# EasyEDA schematic SCH_Recovery-Heltec-Nakuja_2022-10-19.json
TITLE: sheet1; REV: 1.0; Date: 2022-08-31; Sheet: 1/1; Drawn By: bangegeorgeogeto; Company: JKUAT NAKUJA
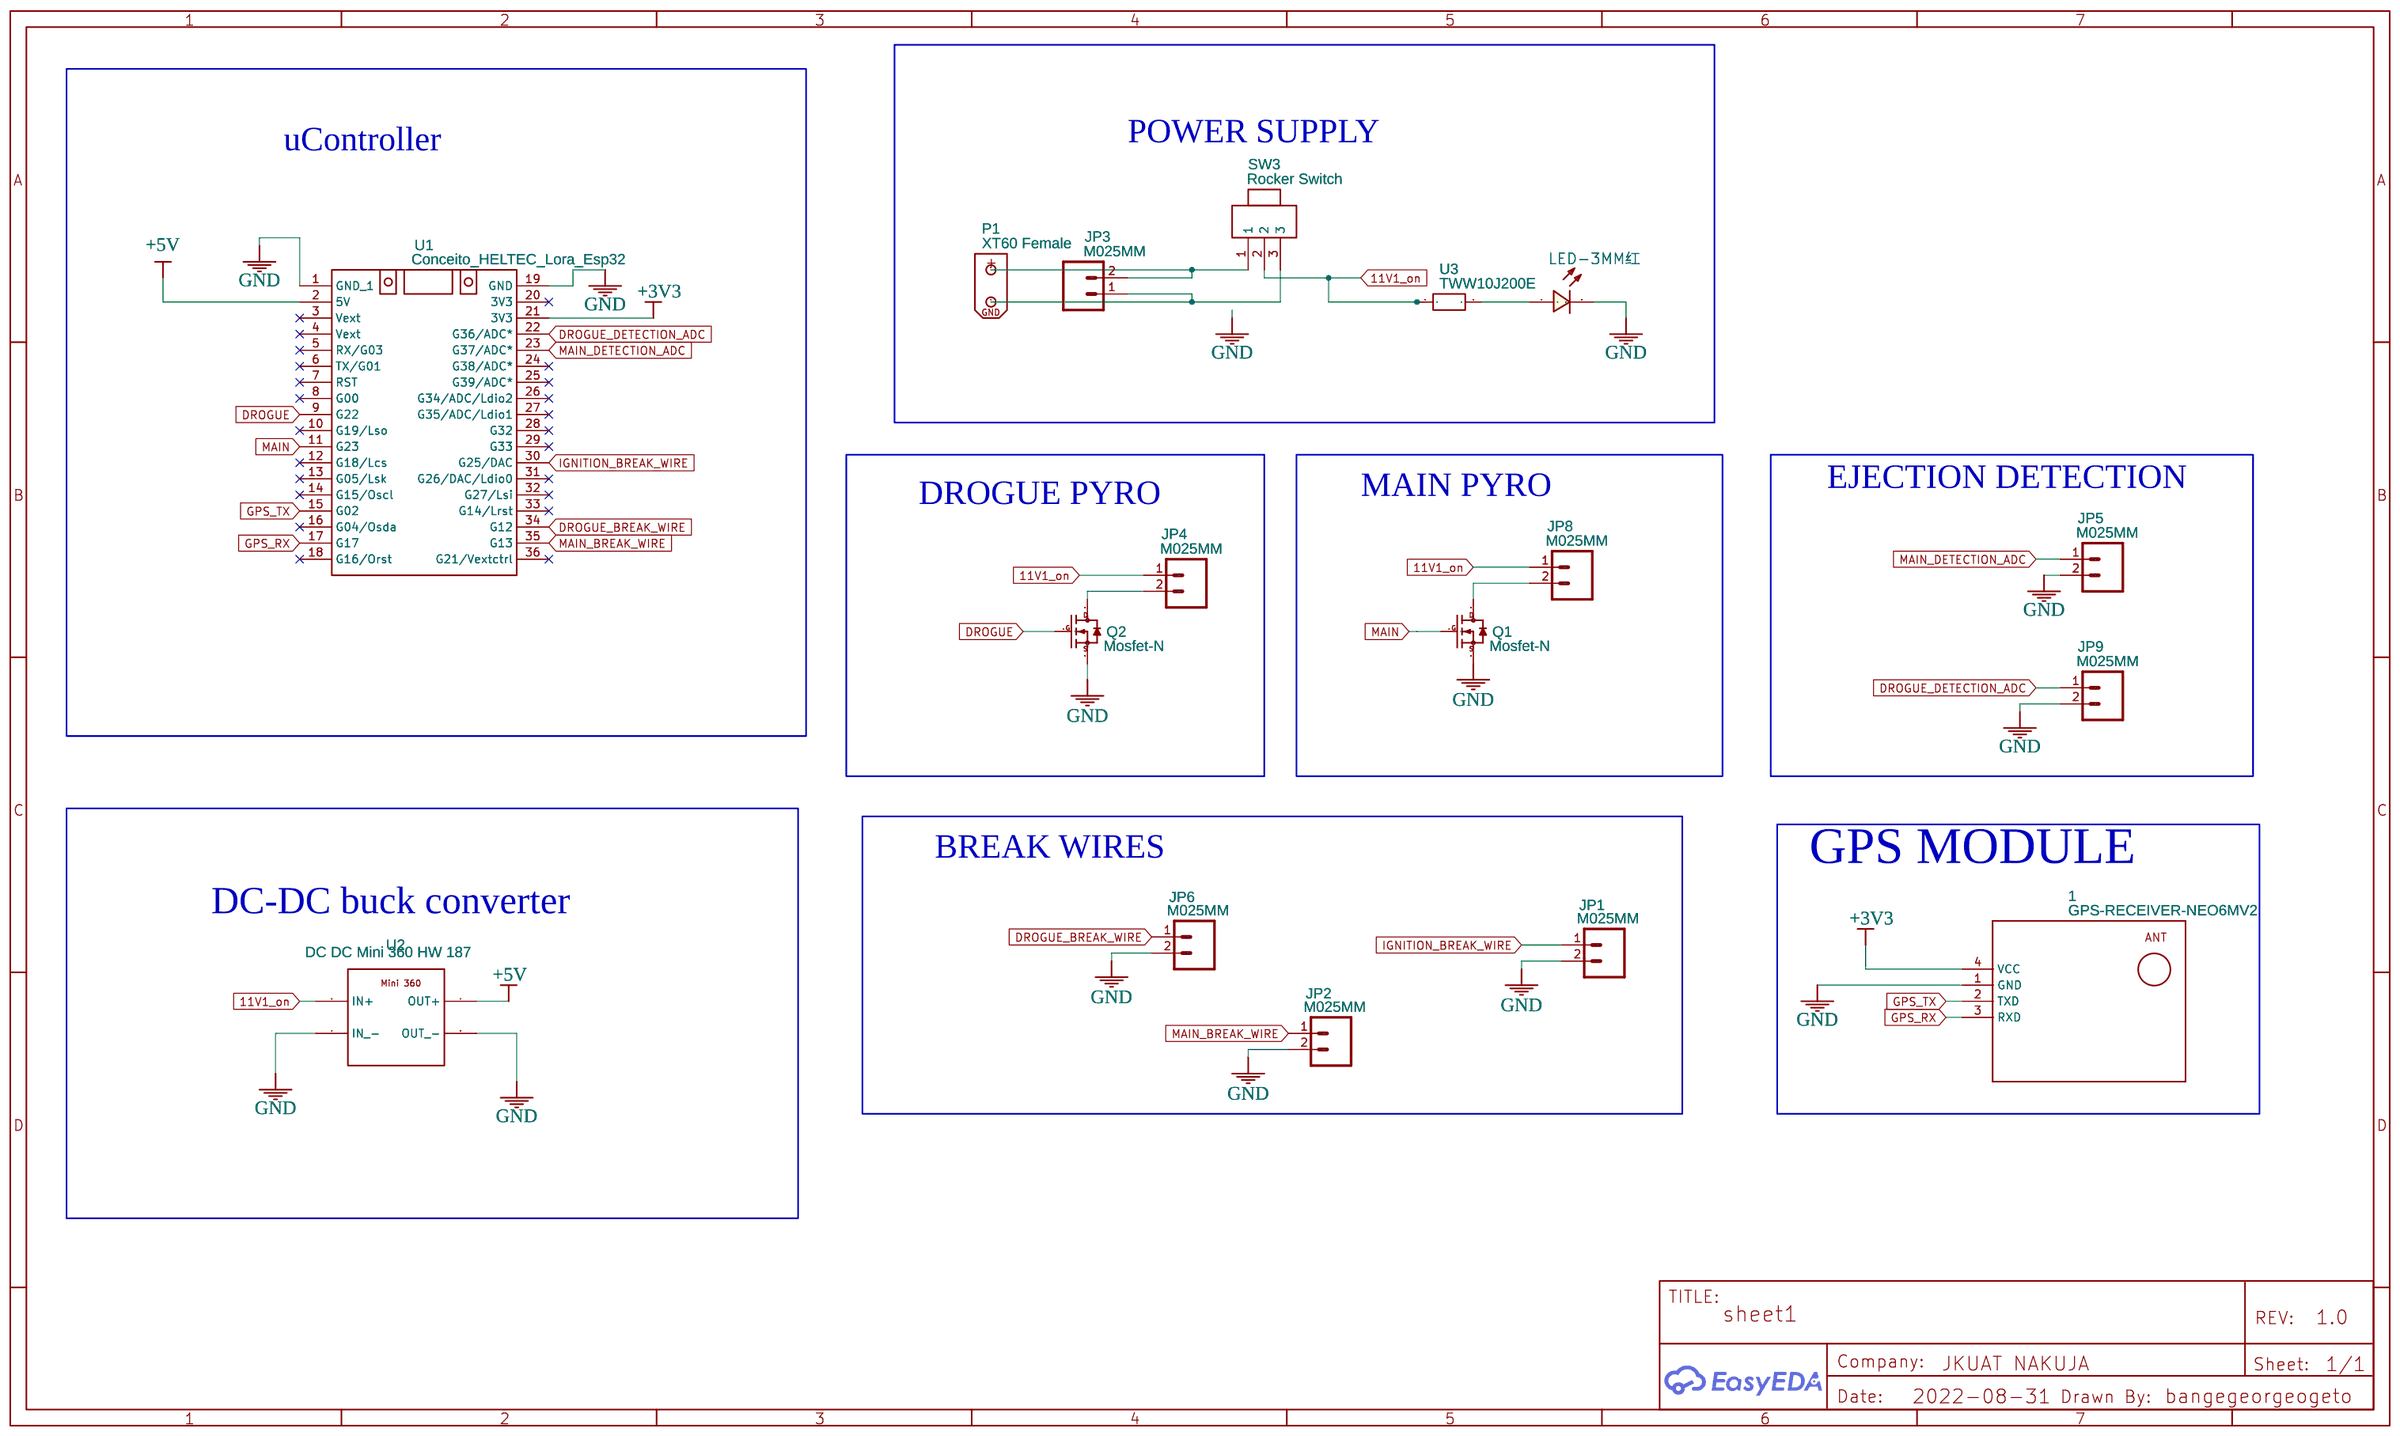
[diagram p0: schematic sheet]

## Parts
1  GPS-RECEIVER-NEO6MV2  [GPS-RECEIVER-NEO6MV2]
JP1  M025MM  [SCREWTERMINAL-5MM-2]
JP2  M025MM  [SCREWTERMINAL-5MM-2]
JP3  M025MM  [SCREWTERMINAL-5MM-2]
JP4  M025MM  [SCREWTERMINAL-5MM-2]
JP5  M025MM  [SCREWTERMINAL-5MM-2]
JP6  M025MM  [SCREWTERMINAL-5MM-2]
JP8  M025MM  [SCREWTERMINAL-5MM-2]
JP9  M025MM  [SCREWTERMINAL-5MM-2]
NO  LED-3MM红  [LED-TH_LED-3MM_RED]
P1  XT60 Female  [XT60-F]
Q1  Mosfet-N  [DC-MOSFET-TO-220]
Q2  Mosfet-N  [DC-MOSFET-TO-220]
SW3  Rocker Switch  [ROCKER SWITCH TH]
U1  Conceito_HELTEC_Lora_Esp32  [HELTEC_LORA_ESP32]
U2  DC DC Mini 360 HW 187  [DC_DC_MINI360]
U3  TWW10J200E  [RES-TH_L12.5-W9.0-P5.00-D1.2]

## Library data of the parts
1 = GPS-RECEIVER-NEO6MV2: Contributor: lolovo
JP1-JP6 JP8 JP9 = M025MM: Contributor: JOHN JAIRO PIÑEROS
NO = LED-3MM红: Supplier: LCSC; Supplier Part: C9900003389; Manufacturer Part: LED-3mm红; link: https://img.jlc.com/pdf/applyPasteComponent/2021-12-06/748033A/127ffe71aa84443fa05d6ffed81d0b6e/LED-3mm.pdf; Contributor: LCSC; JLCPCB Part Class: Extended Part
P1 = XT60 Female: Manufacturer: Changzhou Amass Elec; Contributor: rifanoz
Q1 Q2 = Mosfet-N: Contributor: dina
SW3 = Rocker Switch: Mounted: Yes
U1 = Conceito_HELTEC_Lora_Esp32: Contributor: ConceitoTeam
U2 = DC DC Mini 360 HW 187: Contributor: stanpak; sourceId: FRLFXR8qI
U3 = TWW10J200E: Supplier: LCSC; Supplier Part: C3353311; Manufacturer: Ohmite; link: https://atta.szlcsc.comnull; Resistance: 200Ω; Contributor: lcsc

## Nets
11V1_on: JP4.1 JP8.1 SW3.2 U2.3(IN+) U3.1
+3V3: 1.4(VCC) U1.21(3V3)
+5V: U1.2(5V) U2.1(OUT+)
GND: 1.1(GND) JP1.2 JP2.2 JP5.2 JP6.2 JP9.2 NO.2 Q1.3(S) Q2.3(S) U1.1(GND) U1.19(GND) U2.2(OUT -) U2.4(IN -)
DROGUE: Q2.1(G) U1.9(G22)
DROGUE_BREAK_WIRE: JP6.1 U1.34(G12)
DROGUE_DETECTION_ADC: JP9.1 U1.22(G36/ADC*)
GPS_RX: 1.3(RXD) U1.17(G17)
GPS_TX: 1.2(TXD) U1.15(G02)
IGNITION_BREAK_WIRE: JP1.1 U1.30(G25/DAC)
MAIN: Q1.1(G) U1.11(G23)
MAIN_BREAK_WIRE: JP2.1 U1.35(G13)
MAIN_DETECTION_ADC: JP5.1 U1.23(G37/ADC*)
Net-(JP3-1): JP3.1 P1.1 SW3.3
Net-(JP3-2): JP3.2 P1.2 SW3.1
Net-(JP4-2): JP4.2 Q2.2(D)
Net-(JP8-2): JP8.2 Q1.2(D)
Net-(NO-1): NO.1 U3.2

Not connected (* = marked no-connect by the designer): U1 3(Vext)* 4(Vext)* 5(RX/G03)* 6(TX/G01)* 7(RST)* 8(G00)* 10(G19/Lso)* 12(G18/Lcs)* 13(G05/Lsk)* 14(G15/Oscl)* 16(G04/Osda)* 18(G16/Orst)* 20(3V3)* 24(G38/ADC*)* 25(G39/ADC*)* 26(G34/ADC/Ldio2)* 27(G35/ADC/Ldio1)* 28(G32)* 29(G33)* 31(G26/DAC/Ldio0)* 32(G27/Lsi)* 33(G14/Lrst)* 36(G21/Vextctrl)*

## Notes on the sheet
- uController
- POWER SUPPLY
- EJECTION DETECTION
- DROGUE PYRO
- MAIN PYRO
- GPS MODULE
- BREAK WIRES
- DC-DC buck converter
